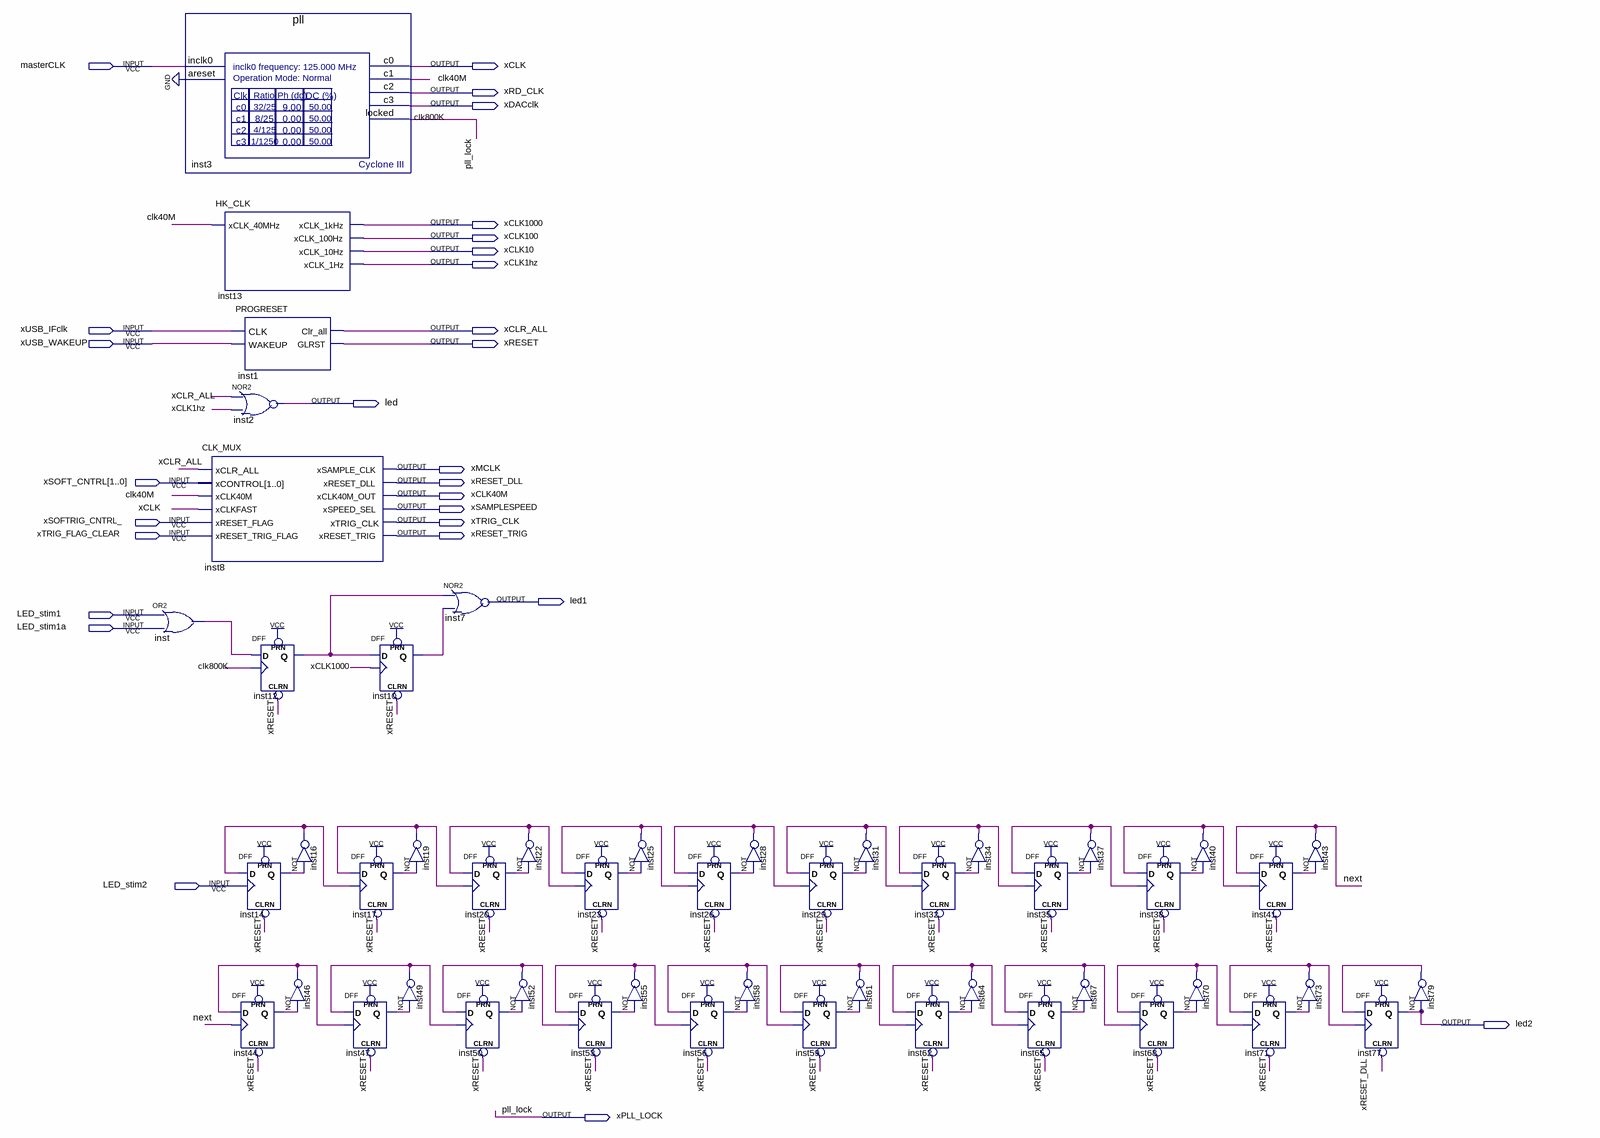
[diagram p0: schematic sheet]
// Quartus schematic CLKmain.bdf as structural Verilog: 51 symbols, 28 pins
module CLKmain (
  input  masterCLK,
  input  xUSB_IFclk,
  input  xUSB_WAKEUP,
  input  [1:0] xSOFT_CNTRL,
  input  xSOFTRIG_CNTRL_,
  input  xTRIG_FLAG_CLEAR,
  input  LED_stim1,
  input  LED_stim1a,
  input  LED_stim2,
  output xCLK,
  output xRD_CLK,
  output xDACclk,
  output xCLK1000,
  output xCLK100,
  output xCLK10,
  output xCLK1hz,
  output xCLR_ALL,
  output xRESET,
  output led,
  output xMCLK,
  output xRESET_DLL,
  output xCLK40M,
  output xSAMPLESPEED,
  output xTRIG_CLK,
  output xRESET_TRIG,
  output led1,
  output led2,
  output xPLL_LOCK
);

  wire clk40M, inst10_q, inst12_q, inst14_q, inst16_out, inst17_q, inst19_out, inst20_q, inst22_out,
       inst23_q, inst25_out, inst26_q, inst28_out, inst29_q, inst31_out, inst32_q, inst34_out, inst35_q,
       inst37_out, inst38_q, inst40_out, inst41_q, inst44_q, inst46_out, inst47_q, inst49_out, inst50_q,
       inst52_out, inst53_q, inst55_out, inst56_q, inst58_out, inst59_q, inst61_out, inst62_q, inst64_out,
       inst65_q, inst67_out, inst68_q, inst70_out, inst71_q, inst73_out, inst79_out, inst_out, next;

  or inst (inst_out, LED_stim1, LED_stim1a);
  pll inst3 (.inclk0(masterCLK), .areset(1'b0), .c0(xCLK), .c1(clk40M), .c2(xRD_CLK), .c3(xDACclk), .locked(xPLL_LOCK));
  HK_CLK inst13 (
    .xCLK_40MHz(clk40M), .xCLK_1kHz(xCLK1000), .xCLK_100Hz(xCLK100), .xCLK_10Hz(xCLK10), .xCLK_1Hz(xCLK1hz));
  CLK_MUX inst8 (
    .xCLR_ALL(xCLR_ALL), .xCONTROL(xSOFT_CNTRL), .xCLK40M(clk40M), .xCLKFAST(xCLK),
    .xRESET_FLAG(xSOFTRIG_CNTRL_), .xRESET_TRIG_FLAG(xTRIG_FLAG_CLEAR), .xSAMPLE_CLK(xMCLK),
    .xRESET_DLL(xRESET_DLL), .xCLK40M_OUT(xCLK40M), .xSPEED_SEL(xSAMPLESPEED), .xTRIG_CLK(xTRIG_CLK),
    .xRESET_TRIG(xRESET_TRIG));
  PROGRESET inst1 (.CLK(xUSB_IFclk), .WAKEUP(xUSB_WAKEUP), .Clr_all(xCLR_ALL), .GLRST(xRESET));
  nor inst2 (led, xCLR_ALL, xCLK1hz);
  DFF inst12 (.CLRN(xRESET), .CLK(xDACclk), .D(inst_out), .PRN(1'b1), .Q(inst12_q));
  DFF inst14 (.CLRN(xRESET), .CLK(LED_stim2), .D(inst16_out), .PRN(1'b1), .Q(inst14_q));
  DFF inst44 (.CLRN(xRESET), .CLK(next), .D(inst46_out), .PRN(1'b1), .Q(inst44_q));
  not inst16 (inst16_out, inst14_q);
  not inst46 (inst46_out, inst44_q);
  DFF inst10 (.CLRN(xRESET), .CLK(xCLK1000), .D(inst12_q), .PRN(1'b1), .Q(inst10_q));
  DFF inst17 (.CLRN(xRESET), .CLK(inst16_out), .D(inst19_out), .PRN(1'b1), .Q(inst17_q));
  DFF inst47 (.CLRN(xRESET), .CLK(inst46_out), .D(inst49_out), .PRN(1'b1), .Q(inst47_q));
  not inst19 (inst19_out, inst17_q);
  not inst49 (inst49_out, inst47_q);
  nor inst7 (led1, inst12_q, inst10_q);
  DFF inst20 (.CLRN(xRESET), .CLK(inst19_out), .D(inst22_out), .PRN(1'b1), .Q(inst20_q));
  DFF inst50 (.CLRN(xRESET), .CLK(inst49_out), .D(inst52_out), .PRN(1'b1), .Q(inst50_q));
  not inst22 (inst22_out, inst20_q);
  not inst52 (inst52_out, inst50_q);
  DFF inst23 (.CLRN(xRESET), .CLK(inst22_out), .D(inst25_out), .PRN(1'b1), .Q(inst23_q));
  DFF inst53 (.CLRN(xRESET), .CLK(inst52_out), .D(inst55_out), .PRN(1'b1), .Q(inst53_q));
  not inst25 (inst25_out, inst23_q);
  not inst55 (inst55_out, inst53_q);
  DFF inst26 (.CLRN(xRESET), .CLK(inst25_out), .D(inst28_out), .PRN(1'b1), .Q(inst26_q));
  DFF inst56 (.CLRN(xRESET), .CLK(inst55_out), .D(inst58_out), .PRN(1'b1), .Q(inst56_q));
  not inst28 (inst28_out, inst26_q);
  not inst58 (inst58_out, inst56_q);
  DFF inst29 (.CLRN(xRESET), .CLK(inst28_out), .D(inst31_out), .PRN(1'b1), .Q(inst29_q));
  DFF inst59 (.CLRN(xRESET), .CLK(inst58_out), .D(inst61_out), .PRN(1'b1), .Q(inst59_q));
  not inst31 (inst31_out, inst29_q);
  not inst61 (inst61_out, inst59_q);
  DFF inst62 (.CLRN(xRESET), .CLK(inst61_out), .D(inst64_out), .PRN(1'b1), .Q(inst62_q));
  DFF inst32 (.CLRN(xRESET), .CLK(inst31_out), .D(inst34_out), .PRN(1'b1), .Q(inst32_q));
  not inst64 (inst64_out, inst62_q);
  not inst34 (inst34_out, inst32_q);
  DFF inst35 (.CLRN(xRESET), .CLK(inst34_out), .D(inst37_out), .PRN(1'b1), .Q(inst35_q));
  DFF inst65 (.CLRN(xRESET), .CLK(inst64_out), .D(inst67_out), .PRN(1'b1), .Q(inst65_q));
  not inst37 (inst37_out, inst35_q);
  not inst67 (inst67_out, inst65_q);
  DFF inst38 (.CLRN(xRESET), .CLK(inst37_out), .D(inst40_out), .PRN(1'b1), .Q(inst38_q));
  DFF inst68 (.CLRN(xRESET), .CLK(inst67_out), .D(inst70_out), .PRN(1'b1), .Q(inst68_q));
  not inst40 (inst40_out, inst38_q);
  not inst70 (inst70_out, inst68_q);
  DFF inst41 (.CLRN(xRESET), .CLK(inst40_out), .D(next), .PRN(1'b1), .Q(inst41_q));
  DFF inst71 (.CLRN(xRESET), .CLK(inst70_out), .D(inst73_out), .PRN(1'b1), .Q(inst71_q));
  not inst43 (next, inst41_q);
  not inst73 (inst73_out, inst71_q);
  DFF inst77 (.CLRN(xRESET_DLL), .CLK(inst73_out), .D(inst79_out), .PRN(1'b1), .Q(led2));
  not inst79 (inst79_out, led2);

  // Other names for the same wires on the sheet: clk800K = xDACclk; pll_lock = xPLL_LOCK
endmodule
